# Altium project server_test.PrjPcb
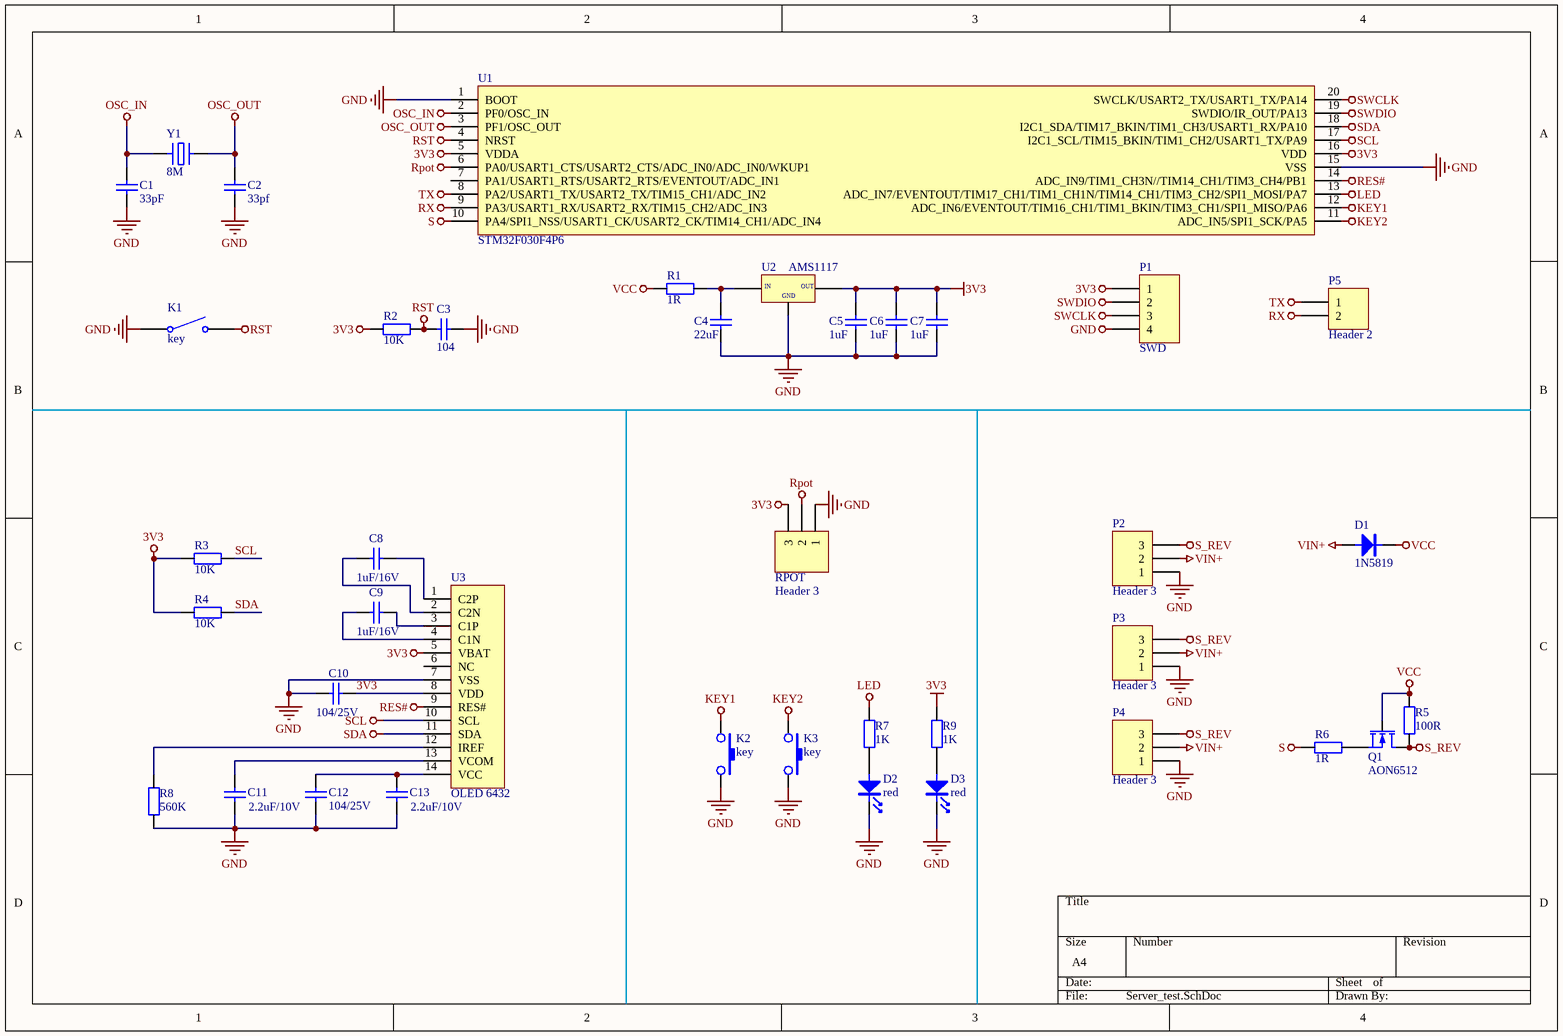
[diagram p0: Server_test.SchDoc]
1 sheet, 39 parts. Net scope: global (net labels, ports and power ports of the same name join across sheets).
Board file: ServoTester.PcbDoc

## Sheet Server_test.SchDoc
size A4

### Parts
C1  33pF  [电容_C0603]
C2  33pf  [电容_C0603]
C3  104  [电容_C0603]
C4  22uF  [电容_C1206]
C5  1uF  [电容_C0603]
C6  1uF  [电容_C0603]
C7  1uF  [电容_C0603]
C8  _Parameter: 1uF/16V  [电容_C0603]  (hidden comment: 1uF)
C9  _Parameter: 1uF/16V  [电容_C0603]  (hidden comment: 1uF)
C10  _Parameter: 104/25V  [电容_C0603]  (hidden comment: 104)
C11  _Parameter: 2.2uF/10V  [电容_C0603]  (hidden comment: 2.2uF)
C12  _Parameter: 104/25V  [电容_C0603]  (hidden comment: 104)
C13  _Parameter: 2.2uF/10V  [电容_C0603]  (hidden comment: 2.2uF)
D1  1N5819  [二极管_SOD-323]
D2  red  [LED_0603]
D3  red  [LED_0603]
K1  key  [开关按键_HY-S2 4.5mm*4.5mm*3.8mm]
K2  key  [开关按键_HY-S2 4.5mm*4.5mm*3.8mm]
K3  key  [开关按键_HY-S2 4.5mm*4.5mm*3.8mm]
P1  SWD  [HDR1X4]
P2  Header 3  [HDR1X3]
P3  Header 3  [HDR1X3]
P4  Header 3  [HDR1X3]
P5  Header 2  [HDR1X2]
Q1  AON6512  [MOS_SOT-23]
R1  1R  [电阻_R0603]
R2  10K  [电阻_R0603]
R3  10K  [电阻_R0603]
R4  10K  [电阻_R0603]
R5  100R  [电阻_R0603]
R6  1R  [电阻_R0603]
R7  1K  [电阻_R0603]
R8  560K  [电阻_R0603]
R9  1K  [电阻_R0603]
RPOT  Header 3  [HDR1X3]
U1  STM32F030F4P6  [ST主控_TSSOP20]
U2  AMS1117  [稳压芯片_SOT-223]
U3  OLED 6432  [Display_OLED 6432 14pin]
Y1  8M  [晶振_5032]

### Nets
3V3: C5.2 C6.2 C7.2 C10.1 P1.1 R2.2 R3.2 R4.2 R9.1 RPOT.3 U1.5(VDDA) U1.16(VDD) U2.2(OUT) U3.5(VBAT) U3.8(VDD)
GND: C1.2 C2.2 C3.1 C4.1 C5.1 C6.1 C7.1 C10.2 C11.1 C12.1 C13.1 D2.K D3.K K1.1 K2.2 K3.2 P1.4 P2.1 P3.1 P4.1 R8.1 RPOT.1 U1.1(BOOT) U1.15(VSS) U2.1(GND) U3.7(VSS) Y1.0
KEY1: K2.1 U1.12(ADC_IN6/EVENTOUT/TIM16_CH1/TIM1_BKIN/TIM3_CH1/SPI1_MISO/PA6)
KEY2: K3.1 U1.11(ADC_IN5/SPI1_SCK/PA5)
LED: R7.1 U1.13(ADC_IN7/EVENTOUT/TIM17_CH1/TIM1_CH1N/TIM14_CH1/TIM3_CH2/SPI1_MOSI/PA7)
OSC_IN: C1.1 U1.2(PF0/OSC_IN) Y1.1
OSC_OUT: C2.1 U1.3(PF1/OSC_OUT) Y1.2
RES#: U1.14(ADC_IN9/TIM1_CH3N//TIM14_CH1/TIM3_CH4/PB1) U3.9(RES#)
Rpot: RPOT.2 U1.6(PA0/USART1_CTS/USART2_CTS/ADC_IN0/ADC_IN0/WKUP1)
RST: C3.2 K1.2 R2.1 U1.4(NRST)
RX: P5.2 U1.9(PA3/USART1_RX/USART2_RX/TIM15_CH2/ADC_IN3)
S: R6.2 U1.10(PA4/SPI1_NSS/USART1_CK/USART2_CK/TIM14_CH1/ADC_IN4)
S_REV: P2.3 P3.3 P4.3 Q1.2(D) R5.2
SCL: R3.1 U1.17(I2C1_SCL/TIM15_BKIN/TIM1_CH2/USART1_TX/PA9) U3.10(SCL)
SDA: R4.1 U1.18(I2C1_SDA/TIM17_BKIN/TIM1_CH3/USART1_RX/PA10) U3.11(SDA)
SWCLK: P1.3 U1.20(SWCLK/USART2_TX/USART1_TX/PA14)
SWDIO: P1.2 U1.19(SWDIO/IR_OUT/PA13)
TX: P5.1 U1.8(PA2/USART1_TX/USART2_TX/TIM15_CH1/ADC_IN2)
VCC: D1.K Q1.1(G) R1.2 R5.1
VIN+: D1.A P2.2 P3.2 P4.2
NetC4_2: C4.2 R1.1 U2.3(VIN)
NetC8_1: C8.1 U3.2(C2N)
NetC8_2: C8.2 U3.1(C2P)
NetC9_1: C9.1 U3.4(C1N)
NetC9_2: C9.2 U3.3(C1P)
NetC11_2: C11.2 U3.13(VCOM)
NetC12_2: C12.2 C13.2 U3.14(VCC)
NetD2_A: D2.A R7.2
NetD3_A: D3.A R9.2
NetQ1_3: Q1.3(S) R6.1
NetR8_2: R8.2 U3.12(IREF)

Not connected (* = marked no-connect by the designer): U1 7(PA1/USART1_RTS/USART2_RTS/EVENTOUT/ADC_IN1); U3 6(NC)

### Notes on the sheet
- (in symbol AMS1117) IN

### Library data of the parts
C1-C7 = cap: U: 50V; 参数: Cap,0805,X7R,104K,50V,125C,±10%
  C1: C: 33pF
  C2: C: 33pf
  C3: C: 104
  C4: C: 22uF
  C5-C7: C: 1uF
C8 C9 = Cap: _Voltage: 16V; _Slash: /; _Specification: Cap,0402,X5R,105K,16V,125C,±10%; _Capacitance: 1uF
C10 C12 = Cap: _Voltage: 25V; _Slash: /; _Specification: Cap,0402,X7R,104K,25V,125C,±10%; _Capacitance: 104
C11 C13 = Cap: _Voltage: 10V; _Slash: /; _Specification: Cap,0402,X5R,225K,10V,125C,±10%; _Capacitance: 2.2uF
D1 = Diode: 参数: Rectifier Diode,DO-41,1N4007,1KV,1A,150C,Tape
D2 D3 = LED: 参数: LED,0603,Red
K1 = KEY-2
K2 K3 = SW-PB: 参数: Key,TS-018A 2*4全包无柱带支架 力度250N; 备注: ADD
P1 = Header 4: Header, 4-Pin; LatestRevisionDate: 17-Jul-2002; LatestRevisionNote: Re-released for DXP Platform.; Publisher: Altium Limited
P2-P4 RPOT = Header 3: Header, 3-Pin; LatestRevisionDate: 17-Jul-2002; LatestRevisionNote: Re-released for DXP Platform.; Publisher: Altium Limited
P5 = Header 2: Header, 2-Pin; LatestRevisionDate: 17-Jul-2002; LatestRevisionNote: Re-released for DXP Platform.; Publisher: Altium Limited
Q1 = MOSFET-N: 参数: N-MOSFET,DFN5*6,AON6512,30V,150A
R1 R2 R5-R7 R9 = Res: P: 1/8W; 参数: Res,0805,0R,±1%,1/8W,100ppm,155C
  R1 R6: R: 1R
  R2: R: 10K
  R5: R: 100R
  R7 R9: R: 1K
R3 R4 = Res: P: 1/16W; 参数: Res,0402,10K,±1%,1/16W,100ppm,155C; R: 10K
R8 = Res: P: 1/16W; 参数: Res,0402,560K,±1%,1/16W,100ppm,155C; R: 560K
U3 = OLED 6432 14Pin: _Comma: ,; _Footprint: 14PIN; _Name: Display; _Specification: Display,OLED 6432,14PIN; _Model: OLED 6432
Y1 = XTAL_B: F: 8M